# EAGLE design bufferboard (EAGLE 6.6.0)
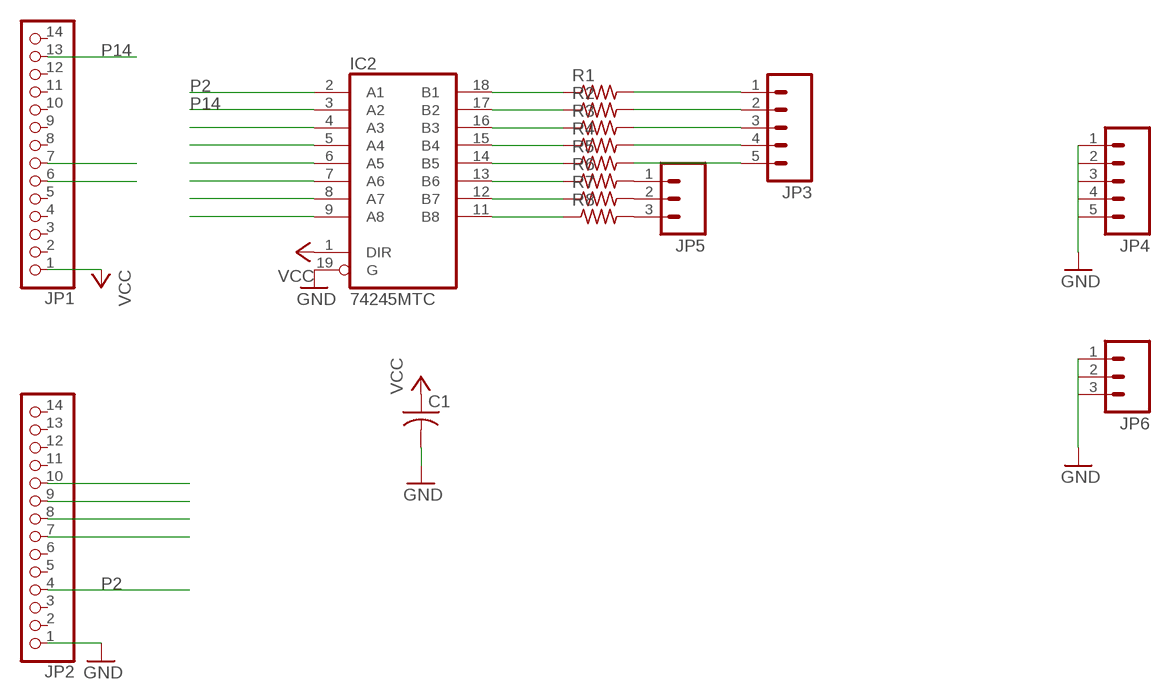
[diagram p0: schematic, sheet 1]

## Parts
C1  C-USC0805  [C0805]
IC2  74245MTC  [SSOP20]
JP1  PINHD-1X14-CB  [1X14-CB]
JP2  PINHD-1X14-CB  [1X14-CB]
JP3  M05NO_SILK  [1X05_NO_SILK]
JP4  M05NO_SILK  [1X05_NO_SILK]
JP5  M031X03_NO_SILK  [1X03_NO_SILK]
JP6  M031X03_NO_SILK  [1X03_NO_SILK]
R1  R-US_R0805  [R0805]
R2  R-US_R0805  [R0805]
R3  R-US_R0805  [R0805]
R4  R-US_R0805  [R0805]
R5  R-US_R0805  [R0805]
R6  R-US_R0805  [R0805]
R7  R-US_R0805  [R0805]
R8  R-US_R0805  [R0805]

## Nets
GND: C1.2 IC2.19(G) JP2.1 JP4.1 JP4.2 JP4.3 JP4.4 JP4.5 JP6.1 JP6.2 JP6.3
N$1: JP5.1 R6.2
N$2: JP5.2 R7.2
N$3: IC2.18(B1) R1.1
N$4: IC2.17(B2) R2.1
N$5: IC2.16(B3) R3.1
N$6: IC2.15(B4) R4.1
N$7: IC2.14(B5) R5.1
N$8: IC2.13(B6) R6.1
N$9: IC2.12(B7) R7.1
N$10: IC2.11(B8) R8.1
N$11: JP5.3 R8.2
N$12: JP3.1 R1.2
N$13: JP3.2 R2.2
N$14: JP3.3 R3.2
N$15: JP3.4 R4.2
N$16: JP3.5 R5.2
P2: IC2.2(A1) JP2.4
P5: IC2.9(A8) JP2.7
P6: IC2.6(A5) JP2.8
P7: IC2.4(A3) JP2.9
P8: IC2.5(A4) JP2.10
P14: IC2.3(A2) JP1.13
P20: IC2.7(A6) JP1.7
P21: IC2.8(A7) JP1.6
VCC: C1.1 IC2.1(DIR) JP1.1
Unconnected: JP1.2 JP1.3 JP1.4 JP1.5 JP1.8 JP1.9 JP1.10 JP1.11 JP1.12 JP1.14 JP2.2 JP2.3 JP2.5 JP2.6 JP2.11 JP2.12 JP2.13 JP2.14

## Power pins joined to a net without a drawn wire
GND: IC2.10(GND)
VCC: IC2.20(VCC)

## Library data of the parts
C1 = adafruit:C-US: CAPACITOR, American symbol
IC2 = adafruit:74*245: Octal BUS TRANSCEIVER, 3-state
JP1 JP2 = adafruit:PINHD-1X14: PIN HEADER
JP3 JP4 = SparkFun-Connectors:M05: Header 5 Standard 5-pin 0.1" header. Use with straight break away headers (SKU : PRT-00116), right angle break away headers (PRT-00553), swiss pins (PRT-00743), machine pins (PRT-00117), and female headers (PRT-00115). Molex polarized connector foot print use with SKU : PRT-08230 with associated crimp pins and housings.
JP5 JP6 = SparkFun-Connectors:M03: Header 3 Standard 3-pin 0.1" header. Use with straight break away headers (SKU : PRT-00116), right angle break away headers (PRT-00553), swiss pins (PRT-00743), machine pins (PRT-00117), and female headers (PRT-00115). Molex polarized connector foot print use with SKU : PRT-08232 with associated crimp pins and housings.
R1-R8 = adafruit:R-US_: RESISTOR, American symbol

## Board
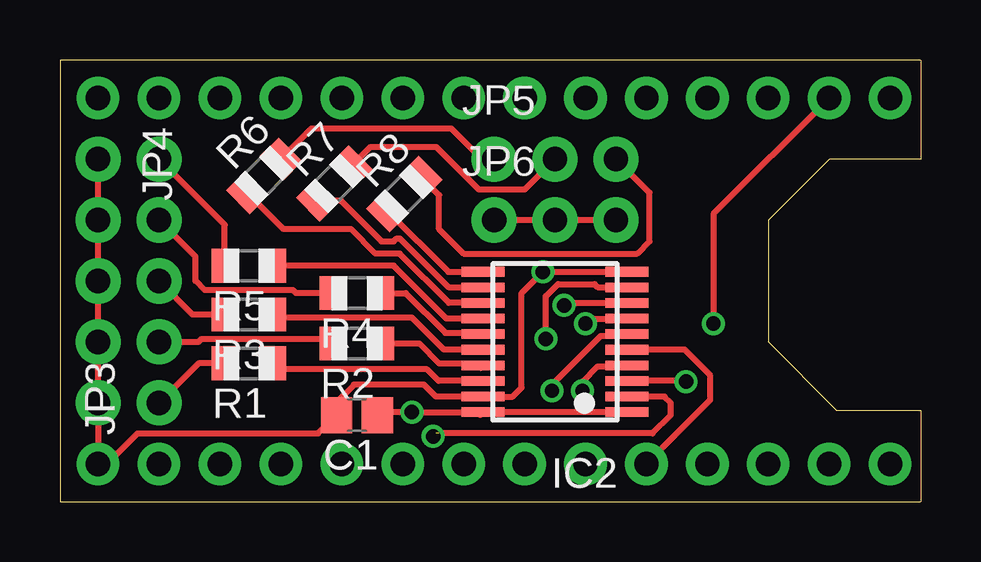
[diagram p1: board, top side]
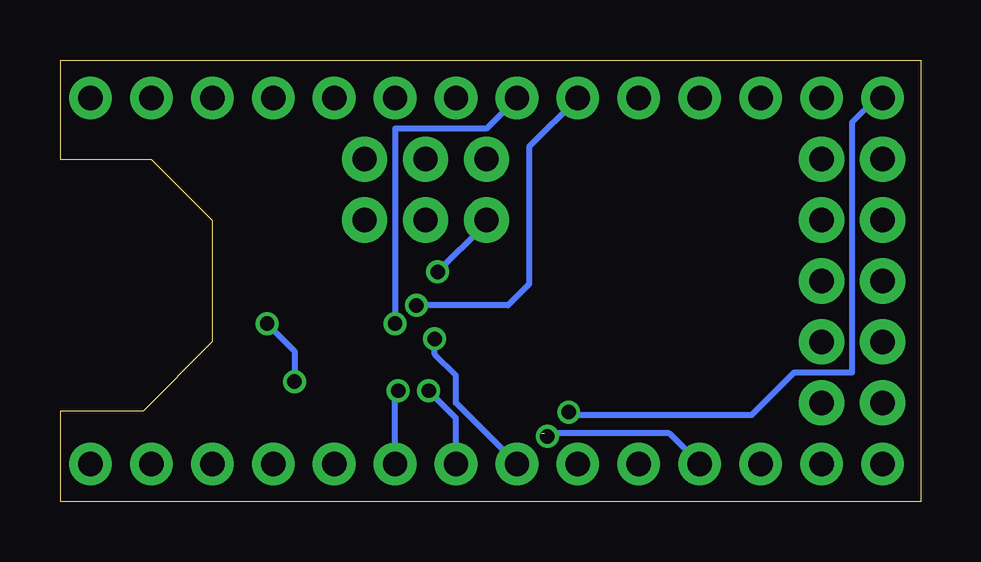
[diagram p2: board, bottom side, seen from below]

Size 35.88 x 18.41 mm. Coordinates in mm from the lower left corner, seen from the top.
Outline: 35.86,0 0,0 0,18.41
Outline: 35.86,18.4 0,18.4
Outline: 35.88,18.41 35.88,14.29 32.07,14.29 29.53,11.75 29.53,6.67 32.39,3.81 35.88,3.81 35.88,0
Copper layers (1*16): Top 0.0356mm / dielectric 1.5011mm / Bottom 0.0356mm
Design rules "OSHPark_Standard": minimum track width 6mil, minimum drill 13mil, track to track 6mil, track to pad 6mil, pad to pad 6mil, via to via 6mil, smd to smd 6mil, copper to edge 15mil, drill to drill 6mil, minimum pad ring 7mil, minimum via ring 7mil, stop-mask expansion 3mil, vias tented up to drill 0mil, thermal gap 10mil

### Footprints (pad centres in the part's own frame; a part is rotated, then mirrored left to right if it is on the bottom)
C0805 = smd 1.3 x 1.5: 1 -0.85,0; 2 0.85,0
SSOP20 = smd 0.4 x 1.8: 1 -2.925,-3; 2 -2.275,-3; 3 -1.625,-3; 4 -0.975,-3; 5 -0.325,-3; 6 0.325,-3; 7 0.975,-3; 8 1.625,-3; 9 2.275,-3; 10 2.925,-3; 11 2.925,3; 12 2.275,3; 13 1.625,3; 14 0.975,3; 15 0.325,3; 16 -0.325,3; 17 -0.975,3; 18 -1.625,3; 19 -2.275,3; 20 -2.925,3
1X14-CB = drill 1.016 pad 1.778: 1 -16.51,0; 2 -13.97,0; 3 -11.43,0; 4 -8.89,0; 5 -6.35,0; 6 -3.81,0; 7 -1.27,0; 8 1.27,0; 9 3.81,0; 10 6.35,0; 11 8.89,0; 12 11.43,0; 13 13.97,0; 14 16.51,0
1X05_NO_SILK = drill 1.016 pad 1.88: 1 0,0; 2 2.54,0; 3 5.08,0; 4 7.62,0; 5 10.16,0
1X03_NO_SILK = drill 1.016 pad 1.88: 1 0,0; 2 2.54,0; 3 5.08,0
R0805 = smd 1.1 x 1.4: 1 -1,0; 2 1,0

### Placement (x,y rotation side)
C1  12.38,3.62 180 top
IC2  20.64,6.67 90 top
JP1  18.1,16.83 0 top
JP2  18.1,1.59 0 top
JP3  4.13,4.13 90 top
JP4  1.59,14.29 270 top
JP5  18.1,14.29 0 top
JP6  18.1,11.75 0 top
R1  7.87,5.78 180 top
R2  12.38,6.6 180 top
R3  7.87,7.81 180 top
R4  12.38,8.7 180 top
R5  7.87,9.84 180 top
R6  8.51,13.59 45 top
R7  11.43,13.27 45 top
R8  14.35,12.83 45 top

### Tracks (layer width: path | path; a pad name or v marks a point on that pad's centre or on a via)
GND  (via drill 0.6)
  Top 0.254: IC2.10 v20.13,9.59 19.24,8.7 19.24,4.76 18.87,4.39 IC2.19 15.67,4.39 15.18,4.89 12.26,4.89 11.49,4.13 11.49,3.66 C1.2 10.77,2.86 3.24,2.86 1.97,1.59 JP2.1 JP4.5 JP4.4 JP4.3 JP4.2 JP4.1 | JP6.1 JP6.2 JP6.3
  Bottom 0.254: JP6.1 18.22,11.75 18.22,11.49 v20.13,9.59
N$1
  Top 0.254: JP5.1 17.59,14.29 16.32,15.56 10.48,15.56 R6.2
N$2
  Top 0.254: JP5.2 19.37,13.02 17.46,13.02 15.68,14.8 12.95,14.8 R7.2
N$3
  Top 0.254: IC2.18 15.79,5.04 15.3,5.52 9.13,5.52 R1.1
N$4
  Top 0.254: 17.53,5.59 IC2.17 17.55,5.78 15.81,5.78 14.99,6.6 R2.1
N$5
  Top 0.254: IC2.16 16.01,6.34 14.67,7.68 9,7.68 R3.1
N$6
  Top 0.254: R4.1 14.41,8.7 16.07,7.05 17.58,7.05 IC2.15
N$7
  Top 0.254: IC2.14 16.11,7.64 13.91,9.84 R5.1
N$8
  Top 0.254: IC2.13 16.22,8.29 14.16,10.35 13.14,10.35 12.13,11.37 9.32,11.37 R6.1
N$9
  Top 0.254: R7.1 11.69,12.56 13.4,10.86 13.91,10.86 14.03,10.99 14.16,10.99 16.19,8.95 17.63,8.95 IC2.12
N$10
  Top 0.254: IC2.11 16.93,9.59 16.19,9.59 13.66,12.12 R8.1
N$11
  Top 0.254: JP5.3 24.57,12.89 24.57,10.86 24.07,10.35 16.83,10.35 15.81,11.37 15.81,12.78 R8.2
N$12
  Top 0.254: R1.2 5.78,5.78 JP3.1
N$13
  Top 0.254: JP3.2 5.78,6.67 5.91,6.79 11.19,6.79 R2.2
N$14
  Top 0.254: R3.2 5.52,7.81 JP3.3
N$15
  Top 0.254: R4.2 9.84,8.7 9.72,8.83 6.03,8.83 5.65,9.21 5.65,10.22 JP3.4
N$16
  Top 0.254: R5.2 6.87,11.54 JP3.5
P2  (via drill 0.6)  (1 unrouted)
  Top 0.254: IC2.2 25.2,4.39 25.46,4.13 25.46,3.62 24.7,2.86 15.68,2.86 v15.56,2.73
  Bottom 0.254: JP2.4 10.48,2.86 15.81,2.86
P5  (via drill 0.6)
  Top 0.254: IC2.9 23.63,8.95 22.42,8.95 22.29,9.08 20.76,9.08 20.26,8.57 v20.26,6.79
  Bottom 0.254: JP2.7 19.37,4.13 19.37,5.27 20.26,6.16 v20.26,6.79
P6  (via drill 0.6)
  Top 0.254: v20.51,4.64 20.51,4.89 22.54,6.92 23.57,6.92 IC2.6
  Bottom 0.254: JP2.8 19.37,3.49 v20.51,4.64
P7  (via drill 0.6)
  Top 0.254: v21.78,4.64 21.78,5.02 22.42,5.65 23.6,5.65 IC2.4
  Bottom 0.254: JP2.9 21.91,4.51 v21.78,4.64
P8
  Top 0.254: JP2.10 27.11,4.25 27.11,5.27 26.04,6.34 IC2.5
P14  (via drill 0.6)
  Top 0.254: JP1.13 27.24,12 v27.24,7.43 | v26.1,5.02 26.07,5.04 IC2.3
  Bottom 0.254: v27.24,7.43 26.1,6.29 v26.1,5.02
P20  (via drill 0.6)
  Top 0.254: v21.91,7.43 22.12,7.64 IC2.7
  Bottom 0.254: JP1.7 18.1,15.56 21.91,15.56 v21.91,7.43
P21  (via drill 0.6)
  Top 0.254: v21.02,8.19 21.12,8.29 IC2.8
  Bottom 0.254: JP1.6 16.32,14.8 16.32,9.08 17.21,8.19 v21.02,8.19
VCC  (via drill 0.6)
  Top 0.254: IC2.1 IC2.20 | 17.51,3.62 IC2.20 | C1.1 13.36,3.75 v14.67,3.75 IC2.20
  Bottom 0.254: JP1.1 1.84,16.83 2.86,15.81 2.86,5.4 5.27,5.4 7.05,3.62 14.54,3.62 v14.67,3.75